# Altium project macro_pad.PrjPcb
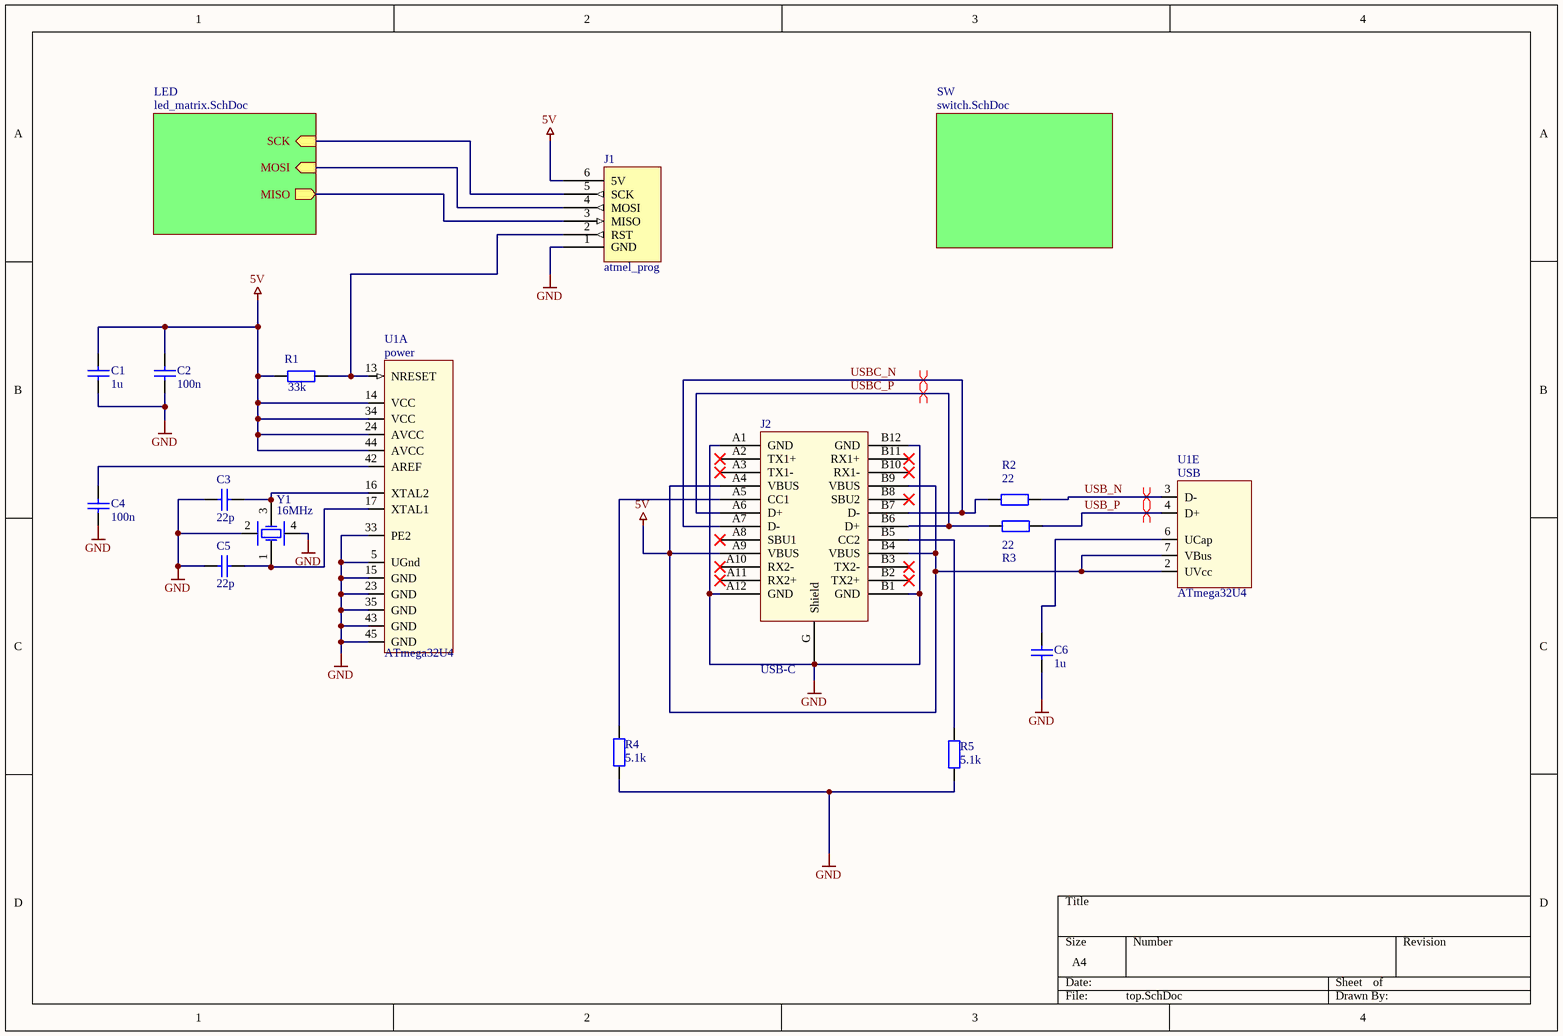
[diagram p0: top.SchDoc]
3 sheets, 67 parts. Net scope: hierarchical (ports join the sheet entries above them; power ports are global).
Board file: macropad.PcbDoc
Sheets:
  top.SchDoc
    SW = switch.SchDoc
    LED = led_matrix.SchDoc

## Sheet top.SchDoc
size A4

### Parts
C1  1u  [0805]
C2  100n  [0805]
C3  22p  [0805]
C4  100n  [0805]
C5  22p  [0805]
C6  1u  [0805]
J1  atmel_prog  [header6p0.2]
J2  USB-C  [usb-c]
R1  33k  [0805]
R2  22  [0805]
R3  22  [0805]
R4  5.1k  [0805]
R5  5.1k  [0805]
U1  ATmega32U4  [QFN44P05P7X7]  (parts A,E of 5)
Y1  16MHz  [SMD_crystal_P220x160S320x250]

### Sub-sheets
LED = led_matrix.SchDoc: SCK (in), MOSI (in), MISO (out)
SW = switch.SchDoc: no entries

### Nets
5V: C1.2 C2.2 J1.6(5V) J2.A4(VBUS) J2.A9(VBUS) J2.B4(VBUS) J2.B9(VBUS) R1.1 U1.2(UVcc) U1.7(VBus) U1.14(VCC) U1.24(AVCC) U1.34(VCC) U1.44(AVCC)
GND: C1.1 C2.1 C3.2 C4.1 C5.2 C6.1 J1.1(GND) J2.A1(GND) J2.A12(GND) J2.B1(GND) J2.B12(GND) J2.G(Shield) R4.2 R5.2 U1.5(UGnd) U1.15(GND) U1.23(GND) U1.33(PE2) U1.35(GND) U1.43(GND) U1.45(GND) Y1.2 Y1.4
USB_N: R2.2 U1.3(D-)
USB_P: R3.2 U1.4(D+)
USBC_N: J2.A7(D-) J2.B7(D-) R2.1
USBC_P: J2.A6(D+) J2.B6(D+) R3.1
NetC3_1: C3.1 U1.16(XTAL2) Y1.3(OSC2)
NetC4_2: C4.2 U1.42(AREF)
NetC5_1: C5.1 U1.17(XTAL1) Y1.1(OSC1)
NetC6_2: C6.2 U1.6(UCap)
NetJ1_2: J1.2(RST) R1.2 U1.13(NRESET)
NetJ1_3: J1.3(MISO) ; sheet LED/MISO
NetJ1_4: J1.4(MOSI) ; sheet LED/MOSI
NetJ1_5: J1.5(SCK) ; sheet LED/SCK
NetJ2_A5: J2.A5(CC1) R4.1
NetJ2_B5: J2.B5(CC2) R5.1

Not connected (* = marked no-connect by the designer): J2 A2(TX1+)* A3(TX1-)* A8(SBU1)* A10(RX2-)* A11(RX2+)* B2(TX2+)* B3(TX2-)* B8(SBU2)* B10(RX1-)* B11(RX1+)*

### Layout directives
differential pair: USB_N, USB_P, USBC_N, USBC_P

### Notes on the sheet
- (in symbol ATmega32U4, part A) power
- (in symbol ATmega32U4, part E) USB

### Library data of the parts
C1-C6 = cap
R1-R5 = res0805
Y1 = xtal

## Sheet switch.SchDoc
size A4
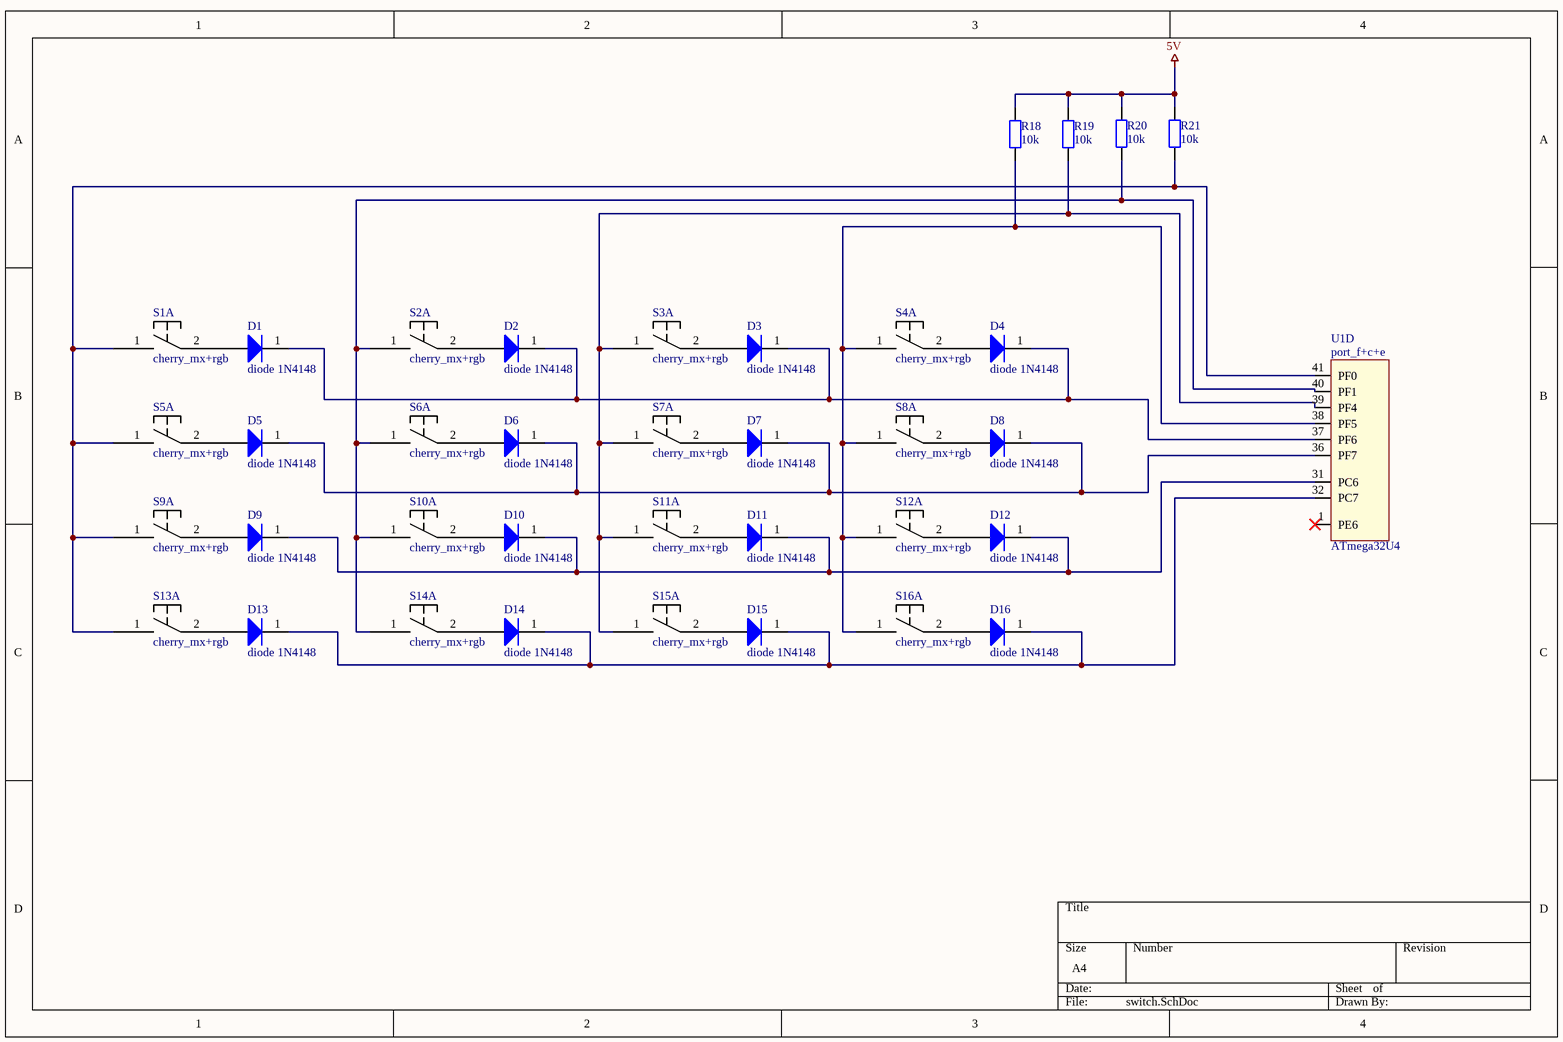
[diagram p1: switch.SchDoc]

### Parts
D1  diode 1N4148  [SOD-323_S130X260]
D2  diode 1N4148  [SOD-323_S130X260]
D3  diode 1N4148  [SOD-323_S130X260]
D4  diode 1N4148  [SOD-323_S130X260]
D5  diode 1N4148  [SOD-323_S130X260]
D6  diode 1N4148  [SOD-323_S130X260]
D7  diode 1N4148  [SOD-323_S130X260]
D8  diode 1N4148  [SOD-323_S130X260]
D9  diode 1N4148  [SOD-323_S130X260]
D10  diode 1N4148  [SOD-323_S130X260]
D11  diode 1N4148  [SOD-323_S130X260]
D12  diode 1N4148  [SOD-323_S130X260]
D13  diode 1N4148  [SOD-323_S130X260]
D14  diode 1N4148  [SOD-323_S130X260]
D15  diode 1N4148  [SOD-323_S130X260]
D16  diode 1N4148  [SOD-323_S130X260]
R18  10k  [0805]
R19  10k  [0805]
R20  10k  [0805]
R21  10k  [0805]
S1  cherry_mx+rgb  [kailh_socket_mx+led]  (part A of 2)
S2  cherry_mx+rgb  [kailh_socket_mx+led]  (part A of 2)
S3  cherry_mx+rgb  [kailh_socket_mx+led]  (part A of 2)
S4  cherry_mx+rgb  [kailh_socket_mx+led]  (part A of 2)
S5  cherry_mx+rgb  [kailh_socket_mx+led]  (part A of 2)
S6  cherry_mx+rgb  [kailh_socket_mx+led]  (part A of 2)
S7  cherry_mx+rgb  [kailh_socket_mx+led]  (part A of 2)
S8  cherry_mx+rgb  [kailh_socket_mx+led]  (part A of 2)
S9  cherry_mx+rgb  [kailh_socket_mx+led]  (part A of 2)
S10  cherry_mx+rgb  [kailh_socket_mx+led]  (part A of 2)
S11  cherry_mx+rgb  [kailh_socket_mx+led]  (part A of 2)
S12  cherry_mx+rgb  [kailh_socket_mx+led]  (part A of 2)
S13  cherry_mx+rgb  [kailh_socket_mx+led]  (part A of 2)
S14  cherry_mx+rgb  [kailh_socket_mx+led]  (part A of 2)
S15  cherry_mx+rgb  [kailh_socket_mx+led]  (part A of 2)
S16  cherry_mx+rgb  [kailh_socket_mx+led]  (part A of 2)
U1  ATmega32U4  [QFN44P05P7X7]  (part D of 5)

### Nets
5V: R18.2 R19.2 R20.2 R21.2
NetD1_1: D1.1(K) D2.1(K) D3.1(K) D4.1(K) U1.37(PF6)
NetD1_2: D1.2(A) S1.2
NetD2_2: D2.2(A) S2.2
NetD3_2: D3.2(A) S3.2
NetD4_2: D4.2(A) S4.2
NetD5_1: D5.1(K) D6.1(K) D7.1(K) D8.1(K) U1.36(PF7)
NetD5_2: D5.2(A) S5.2
NetD6_2: D6.2(A) S6.2
NetD7_2: D7.2(A) S7.2
NetD8_2: D8.2(A) S8.2
NetD9_1: D9.1(K) D10.1(K) D11.1(K) D12.1(K) U1.31(PC6)
NetD9_2: D9.2(A) S9.2
NetD10_2: D10.2(A) S10.2
NetD11_2: D11.2(A) S11.2
NetD12_2: D12.2(A) S12.2
NetD13_1: D13.1(K) D14.1(K) D15.1(K) D16.1(K) U1.32(PC7)
NetD13_2: D13.2(A) S13.2
NetD14_2: D14.2(A) S14.2
NetD15_2: D15.2(A) S15.2
NetD16_2: D16.2(A) S16.2
NetR18_1: R18.1 S4.1 S8.1 S12.1 S16.1 U1.38(PF5)
NetR19_1: R19.1 S3.1 S7.1 S11.1 S15.1 U1.39(PF4)
NetR20_1: R20.1 S2.1 S6.1 S10.1 S14.1 U1.40(PF1)
NetR21_1: R21.1 S1.1 S5.1 S9.1 S13.1 U1.41(PF0)

Not connected (* = marked no-connect by the designer): U1 1(PE6)*

### Notes on the sheet
- (in symbol ATmega32U4, part D) port_f+c+e

### Library data of the parts
R18-R21 = res0805

## Sheet led_matrix.SchDoc
size A4
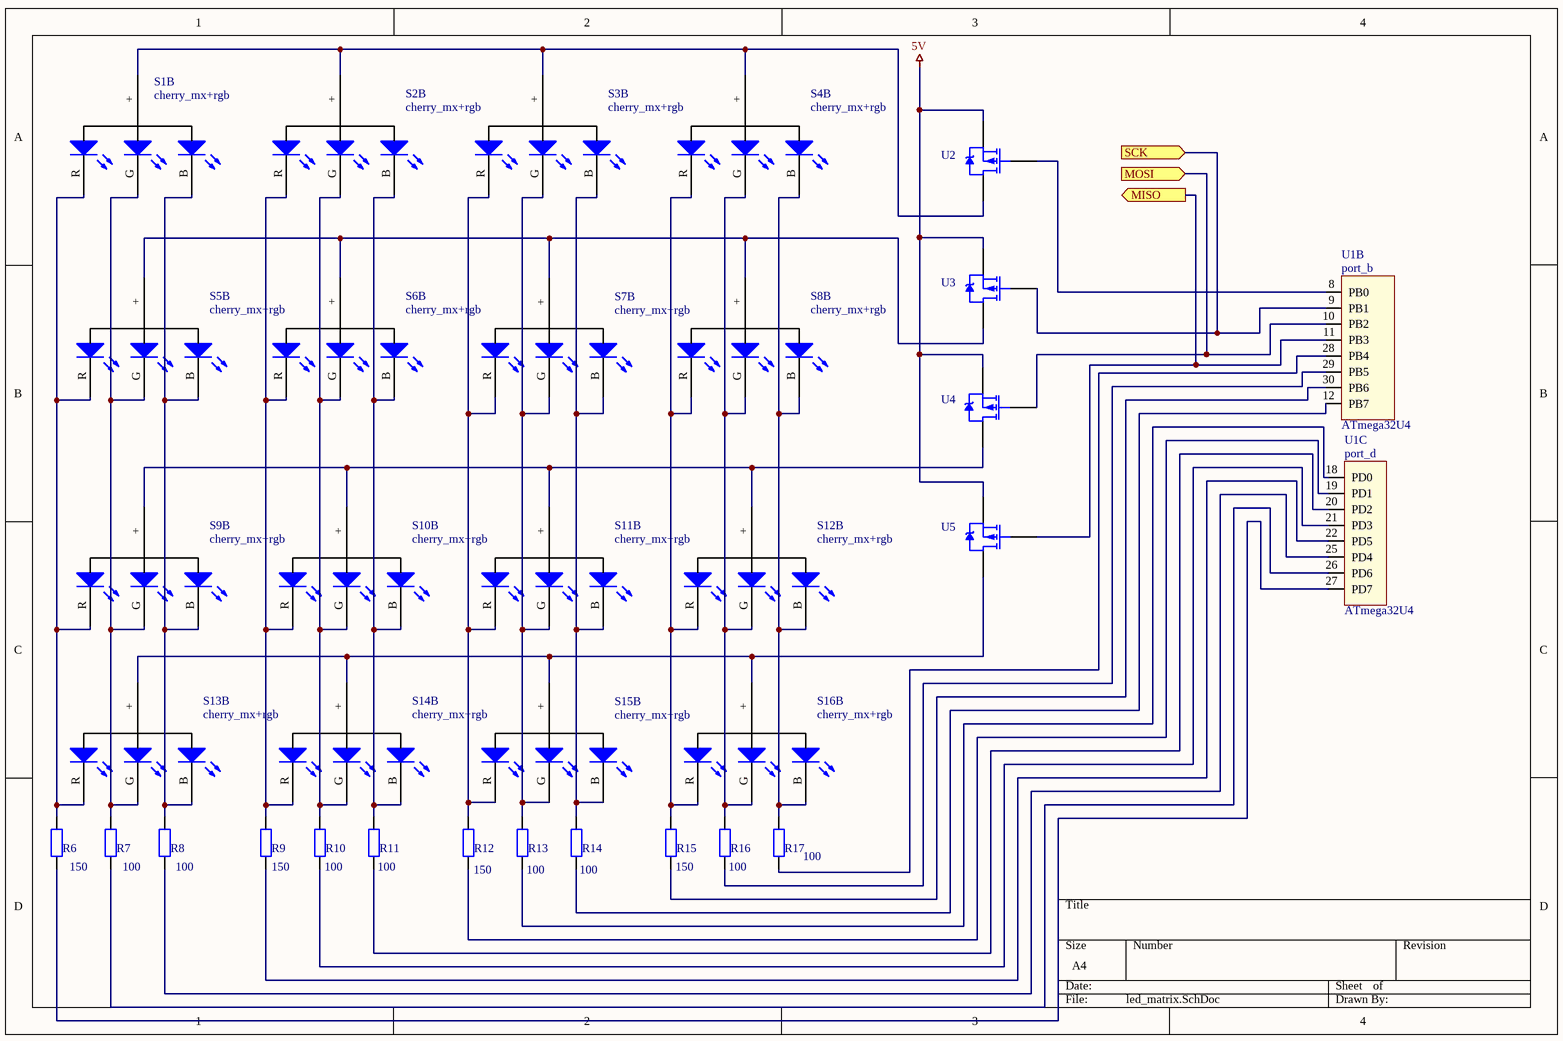
[diagram p2: led_matrix.SchDoc]

### Parts
R6  150  [0805]
R7  100  [0805]
R8  100  [0805]
R9  150  [0805]
R10  100  [0805]
R11  100  [0805]
R12  150  [0805]
R13  100  [0805]
R14  100  [0805]
R15  150  [0805]
R16  100  [0805]
R17  100  [0805]
S1  cherry_mx+rgb  [kailh_socket_mx+led]  (part B of 2)
S2  cherry_mx+rgb  [kailh_socket_mx+led]  (part B of 2)
S3  cherry_mx+rgb  [kailh_socket_mx+led]  (part B of 2)
S4  cherry_mx+rgb  [kailh_socket_mx+led]  (part B of 2)
S5  cherry_mx+rgb  [kailh_socket_mx+led]  (part B of 2)
S6  cherry_mx+rgb  [kailh_socket_mx+led]  (part B of 2)
S7  cherry_mx+rgb  [kailh_socket_mx+led]  (part B of 2)
S8  cherry_mx+rgb  [kailh_socket_mx+led]  (part B of 2)
S9  cherry_mx+rgb  [kailh_socket_mx+led]  (part B of 2)
S10  cherry_mx+rgb  [kailh_socket_mx+led]  (part B of 2)
S11  cherry_mx+rgb  [kailh_socket_mx+led]  (part B of 2)
S12  cherry_mx+rgb  [kailh_socket_mx+led]  (part B of 2)
S13  cherry_mx+rgb  [kailh_socket_mx+led]  (part B of 2)
S14  cherry_mx+rgb  [kailh_socket_mx+led]  (part B of 2)
S15  cherry_mx+rgb  [kailh_socket_mx+led]  (part B of 2)
S16  cherry_mx+rgb  [kailh_socket_mx+led]  (part B of 2)
U1  ATmega32U4  [QFN44P05P7X7]  (parts B,C of 5)
U2  P-mosfet_NX300PBK  [SOT23(TO-236AB)P095S230x290]  (value not drawn)
U3  P-mosfet_NX300PBK  [SOT23(TO-236AB)P095S230x290]  (value not drawn)
U4  P-mosfet_NX300PBK  [SOT23(TO-236AB)P095S230x290]  (value not drawn)
U5  P-mosfet_NX300PBK  [SOT23(TO-236AB)P095S230x290]  (value not drawn)

### Ports
MISO (out), MOSI (in), SCK (in)

### Nets
5V: U2.2(S) U3.2(S) U4.2(S) U5.2(S)
NetJ1_3: U1.11(PB3) U5.1(G) ; port MISO
NetJ1_4: U1.10(PB2) U4.1(G) ; port MOSI
NetJ1_5: U1.9(PB1) U3.1(G) ; port SCK
NetR6_1: R6.1 U1.27(PD7)
NetR6_2: R6.2 S1.R S5.R S9.R S13.R
NetR7_1: R7.1 U1.26(PD6)
NetR7_2: R7.2 S1.G S5.G S9.G S13.G
NetR8_1: R8.1 U1.25(PD4)
NetR8_2: R8.2 S1.B S5.B S9.B S13.B
NetR9_1: R9.1 U1.22(PD5)
NetR9_2: R9.2 S2.R S6.R S10.R S14.R
NetR10_1: R10.1 U1.21(PD3)
NetR10_2: R10.2 S2.G S6.G S10.G S14.G
NetR11_1: R11.1 U1.20(PD2)
NetR11_2: R11.2 S2.B S6.B S10.B S14.B
NetR12_1: R12.1 U1.19(PD1)
NetR12_2: R12.2 S3.R S7.R S11.R S15.R
NetR13_1: R13.1 U1.18(PD0)
NetR13_2: R13.2 S3.G S7.G S11.G S15.G
NetR14_1: R14.1 U1.12(PB7)
NetR14_2: R14.2 S3.B S7.B S11.B S15.B
NetR15_1: R15.1 U1.30(PB6)
NetR15_2: R15.2 S4.R S8.R S12.R S16.R
NetR16_1: R16.1 U1.29(PB5)
NetR16_2: R16.2 S4.G S8.G S12.G S16.G
NetR17_1: R17.1 U1.28(PB4)
NetR17_2: R17.2 S4.B S8.B S12.B S16.B
NetS1_+: S1.+ S2.+ S3.+ S4.+ U2.3(D)
NetS5_+: S5.+ S6.+ S7.+ S8.+ U3.3(D)
NetS9_+: S9.+ S10.+ S11.+ S12.+ U4.3(D)
NetS13_+: S13.+ S14.+ S15.+ S16.+ U5.3(D)
NetU1_8: U1.8(PB0) U2.1(G)

### Notes on the sheet
- (in symbol ATmega32U4, part B) port_b
- (in symbol ATmega32U4, part C) port_d

### Library data of the parts
R6-R17 = res0805

## Nets that join several sheets
5V: top (14 pins), switch (R18.2 R19.2 R20.2 R21.2), led_matrix (U2.2 U3.2 U4.2 U5.2)
NetJ1_3: top (J1.3), led_matrix (U1.11 U5.1)
NetJ1_4: top (J1.4), led_matrix (U1.10 U4.1)
NetJ1_5: top (J1.5), led_matrix (U1.9 U3.1)